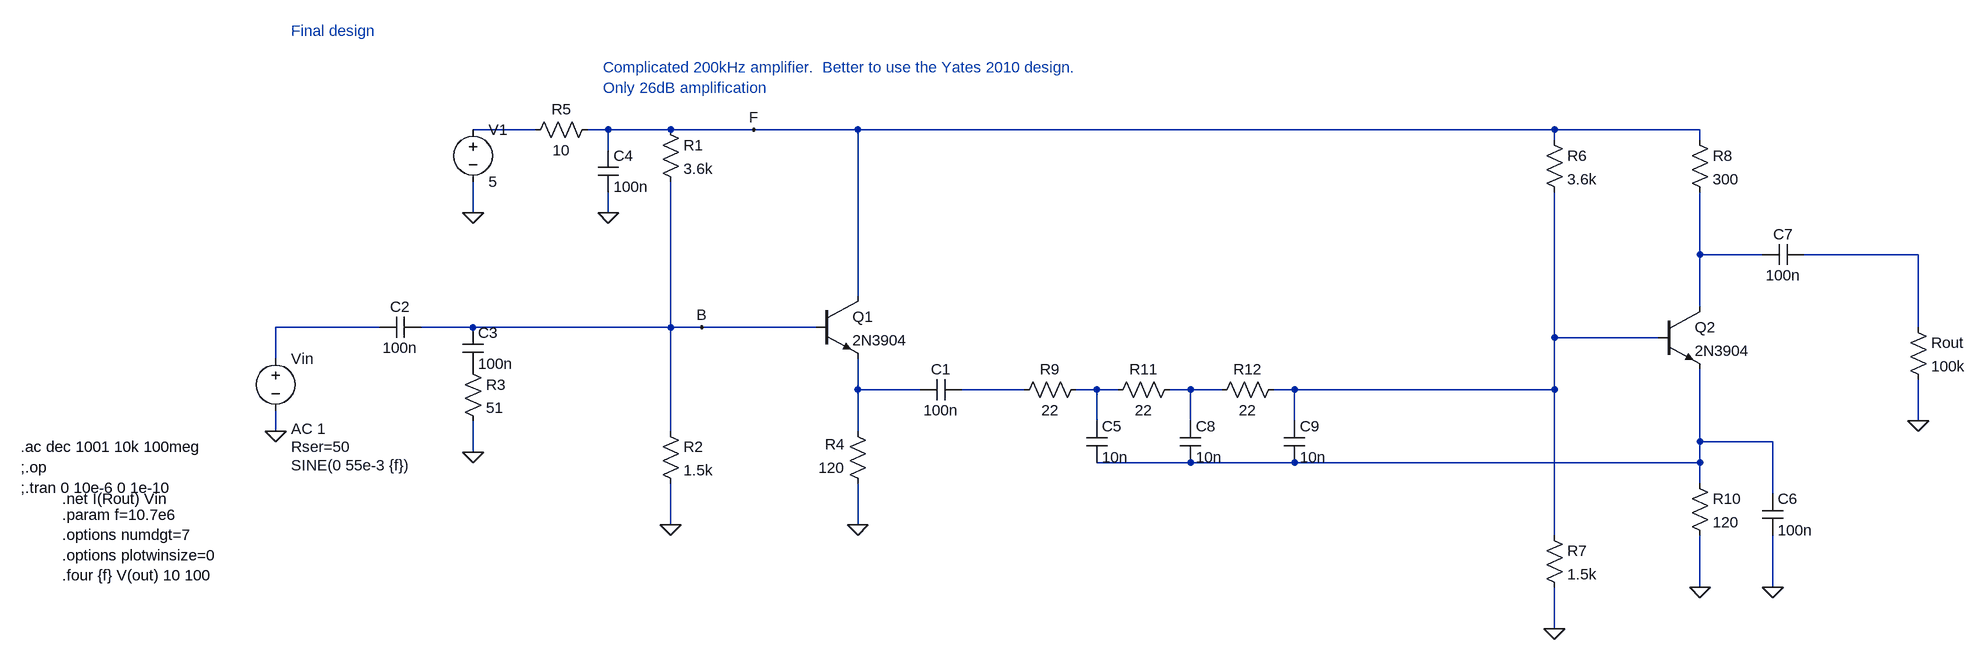
[diagram p0: schematic complicated_IF_amp.asc]
complicated_IF_amp.asc, the LTspice schematic file:
Version 4
SHEET 1 2464 680
WIRE 256 -176 160 -176
WIRE 368 -176 336 -176
WIRE 464 -176 368 -176
WIRE 592 -176 464 -176
WIRE 752 -176 592 -176
WIRE 1824 -176 752 -176
WIRE 2048 -176 1824 -176
WIRE 1824 -160 1824 -176
WIRE 2048 -160 2048 -176
WIRE 368 -144 368 -176
WIRE 160 -48 160 -96
WIRE 368 -48 368 -80
WIRE 2048 16 2048 -80
WIRE 2144 16 2048 16
WIRE 2384 16 2208 16
WIRE 752 80 752 -176
WIRE 2048 96 2048 16
WIRE 16 128 -144 128
WIRE 160 128 80 128
WIRE 464 128 464 -96
WIRE 464 128 160 128
WIRE 512 128 464 128
WIRE 688 128 512 128
WIRE 2384 128 2384 16
WIRE 1824 144 1824 -80
WIRE 1984 144 1824 144
WIRE -144 176 -144 128
WIRE 752 224 752 176
WIRE 848 224 752 224
WIRE 1008 224 912 224
WIRE 1120 224 1088 224
WIRE 1152 224 1120 224
WIRE 1264 224 1232 224
WIRE 1312 224 1264 224
WIRE 1424 224 1392 224
WIRE 1824 224 1824 144
WIRE 1824 224 1424 224
WIRE 1120 272 1120 224
WIRE 1264 272 1264 224
WIRE 1424 272 1424 224
WIRE 2384 272 2384 208
WIRE -144 288 -144 256
WIRE 464 288 464 128
WIRE 752 288 752 224
WIRE 2048 304 2048 192
WIRE 2160 304 2048 304
WIRE 160 320 160 272
WIRE 1264 336 1120 336
WIRE 1424 336 1264 336
WIRE 2048 336 2048 304
WIRE 2048 336 1424 336
WIRE 2048 368 2048 336
WIRE 2160 384 2160 304
WIRE 464 432 464 368
WIRE 752 432 752 368
WIRE 1824 448 1824 224
WIRE 2048 528 2048 448
WIRE 2160 528 2160 448
WIRE 1824 592 1824 528
FLAG 464 432 0
FLAG 752 432 0
FLAG 160 -48 0
FLAG -144 288 0
FLAG 368 -48 0
FLAG 512 128 B
FLAG 592 -176 F
FLAG 160 320 0
FLAG 1824 592 0
FLAG 2048 528 0
FLAG 2160 528 0
FLAG 2384 272 0
SYMBOL npn 688 80 R0
SYMATTR InstName Q1
SYMATTR Value 2N3904
SYMBOL res 448 -192 R0
SYMATTR InstName R1
SYMATTR Value 3.6k
SYMBOL res 448 272 R0
SYMATTR InstName R2
SYMATTR Value 1.5k
SYMBOL res 768 384 R180
WINDOW 0 36 76 Left 2
WINDOW 3 36 40 Left 2
SYMATTR InstName R4
SYMATTR Value 120
SYMBOL cap 16 144 R270
WINDOW 0 32 32 VTop 2
WINDOW 3 0 32 VBottom 2
SYMATTR InstName C2
SYMATTR Value 100n
SYMBOL voltage 160 -192 R0
WINDOW 123 0 0 Left 0
WINDOW 39 0 0 Left 0
SYMATTR InstName V1
SYMATTR Value 5
SYMBOL voltage -144 160 R0
WINDOW 3 24 180 Left 2
WINDOW 123 24 124 Left 2
WINDOW 39 24 152 Left 2
SYMATTR Value SINE(0 55e-3 {f})
SYMATTR Value2 AC 1
SYMATTR SpiceLine Rser=50
SYMATTR InstName Vin
SYMBOL res 352 -192 R90
WINDOW 0 0 56 VBottom 2
WINDOW 3 32 56 VTop 2
SYMATTR InstName R5
SYMATTR Value 10
SYMBOL cap 352 -144 R0
SYMATTR InstName C4
SYMATTR Value 100n
SYMBOL cap 848 240 R270
WINDOW 0 32 32 VTop 2
WINDOW 3 0 32 VBottom 2
SYMATTR InstName C1
SYMATTR Value 100n
SYMBOL cap 144 128 R0
SYMATTR InstName C3
SYMATTR Value 100n
SYMBOL res 144 176 R0
SYMATTR InstName R3
SYMATTR Value 51
SYMBOL npn 1984 96 R0
SYMATTR InstName Q2
SYMATTR Value 2N3904
SYMBOL res 1808 -176 R0
SYMATTR InstName R6
SYMATTR Value 3.6k
SYMBOL res 1808 432 R0
SYMATTR InstName R7
SYMATTR Value 1.5k
SYMBOL res 2032 -176 R0
SYMATTR InstName R8
SYMATTR Value 300
SYMBOL res 1104 208 R90
WINDOW 0 0 56 VBottom 2
WINDOW 3 32 56 VTop 2
SYMATTR InstName R9
SYMATTR Value 22
SYMBOL cap 1104 272 R0
SYMATTR InstName C5
SYMATTR Value 10n
SYMBOL res 2032 352 R0
SYMATTR InstName R10
SYMATTR Value 120
SYMBOL cap 2144 384 R0
SYMATTR InstName C6
SYMATTR Value 100n
SYMBOL cap 2208 0 R90
WINDOW 0 0 32 VBottom 2
WINDOW 3 32 32 VTop 2
SYMATTR InstName C7
SYMATTR Value 100n
SYMBOL res 2368 112 R0
SYMATTR InstName Rout
SYMATTR Value 100k
SYMBOL res 1248 208 R90
WINDOW 0 0 56 VBottom 2
WINDOW 3 32 56 VTop 2
SYMATTR InstName R11
SYMATTR Value 22
SYMBOL cap 1248 272 R0
SYMATTR InstName C8
SYMATTR Value 10n
SYMBOL res 1408 208 R90
WINDOW 0 0 56 VBottom 2
WINDOW 3 32 56 VTop 2
SYMATTR InstName R12
SYMATTR Value 22
SYMBOL cap 1408 272 R0
SYMATTR InstName C9
SYMATTR Value 10n
TEXT -472 392 Left 2 !.net I(Rout) Vin
TEXT -536 312 Left 2 !.ac dec 1001 10k 100meg\n;.op\n;.tran 0 10e-6 0 1e-10
TEXT -472 416 Left 2 !.param f=10.7e6\n.options numdgt=7\n.options plotwinsize=0\n.four {f} V(out) 10 100
TEXT -120 -328 Left 2 ;Final design
TEXT 360 -272 Left 2 ;Complicated 200kHz amplifier.  Better to use the Yates 2010 design.\nOnly 26dB amplification

The netlist it stands for:
* complicated_IF_amp.asc
Q1 F B N006 0 2N3904
R1 F B 3.6k
R2 B 0 1.5k
R4 0 N006 120
C2 N004 B 100n
V1 N001 0 5
Vin N004 0 SINE(0 55e-3 {f}) AC 1 Rser=50
R5 F N001 10
C4 F 0 100n
C1 N006 N007 100n
C3 B P001 100n
R3 P001 0 51
Q2 N002 N005 N010 0 2N3904
R6 F N005 3.6k
R7 N005 0 1.5k
R8 F N002 300
R9 N008 N007 22
C5 N008 N010 10n
R10 N010 0 120
C6 N010 0 100n
C7 N003 N002 100n
Rout N003 0 100k
R11 N009 N008 22
C8 N009 N010 10n
R12 N005 N009 22
C9 N005 N010 10n
.model NPN NPN
.model PNP PNP
.lib standard.bjt
.net I(Rout) Vin
.ac dec 1001 10k 100meg
;.op
;.tran 0 10e-6 0 1e-10
.param f=10.7e6
.options numdgt=7
.options plotwinsize=0
.four {f} V(out) 10 100
* Final design
* Complicated 200kHz amplifier.  Better to use the Yates 2010 design.
* Only 26dB amplification
.backanno
.end